# Altium schematic sheet Power.SchDoc: Plant - Power
size A4; Author: Carlos de la Fuente; CompanyName: ekuore; DrawnBy: Carlos de la Fuente; Engineer: Carlos de la Fuente; Organization: eKuore; Revision: 0.2; SheetNumber: 3; SheetTotal: 5
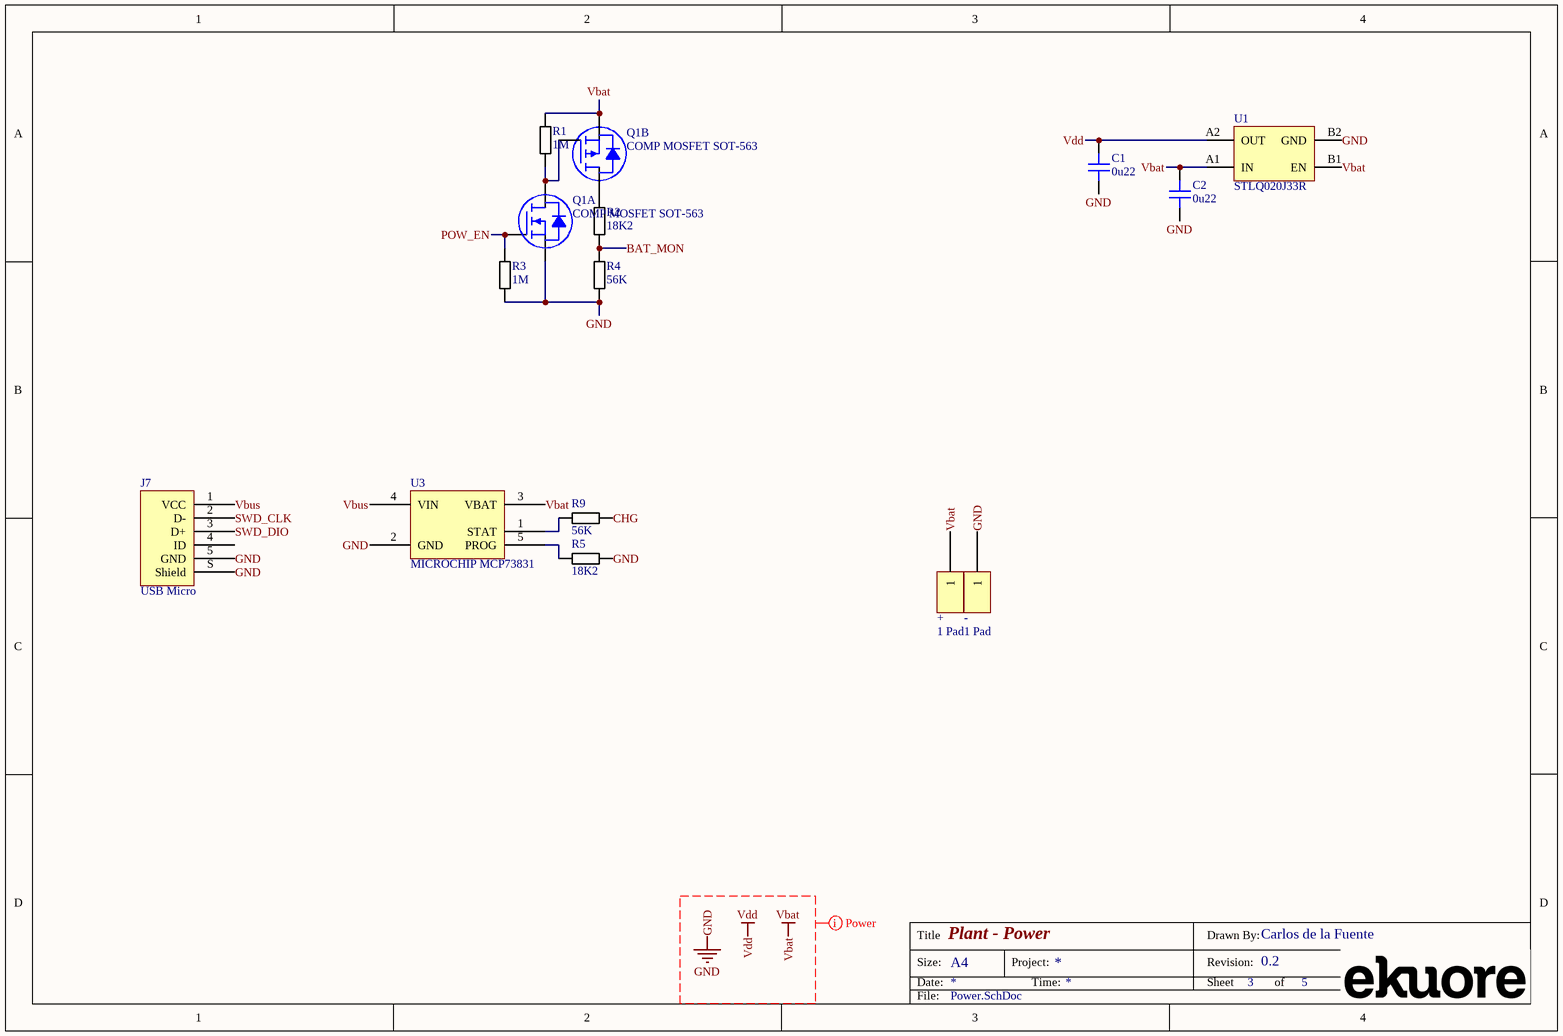
[diagram p0: Power.SchDoc]

## Parts
+  1 Pad  [HARWIN P70 - CONTACT]  (no BOM)
-  1 Pad  [HARWIN P70 - CONTACT]  (no BOM)
C1  0u22  [CAP 0201/0603]
C2  0u22  [CAP 0201/0603]
J7  USB Micro  [Amphenol 10118192]
Q1  COMP MOSFET SOT-563  [ON SEMI SOT563]  (parts A,B of 2)
R1  1M  [RES 0402/1005]
R2  18K2  [RES 0402/1005]
R3  1M  [RES 0402/1005]
R4  56K  [RES 0402/1005]
R5  18K2  [RES 0402/1005]
R9  56K  [RES 0402/1005]
U1  STLQ020J33R  [ST flip-chip4]
U3  MICROCHIP MCP73831  [MICROCHIP SOT-23-5]

## Nets
GND: -.1 C1.1 C2.1 J7.5(GND) J7.S(Shield) Q1.1(S1) R3.1 R4.1 R5.1 U1.B2(GND) U3.2(GND)
Vbat: +.1 C2.2 Q1.4(S2) R1.2 U1.A1(IN) U1.B1(EN) U3.3(VBAT)
Vdd: C1.2 U1.A2(OUT)
BAT_MON: R2.1 R4.2
CHG: R9.2
POW_EN: Q1.2(G1) R3.2
SWD_CLK: J7.2(D-)
SWD_DIO: J7.3(D+)
Vbus: J7.1(VCC) U3.4(VIN)
NetQ1_3: Q1.3(D2) R2.2
NetQ1_5: Q1.5(G2) Q1.6(D1) R1.1
NetR5_2: R5.2 U3.5(PROG)
NetR9_1: R9.1 U3.1(STAT)

Not connected (* = marked no-connect by the designer): J7 4(ID)

## Layout directives
net class Power: GND, Vbat, Vdd

## Notes on the sheet
- Title
- Size:
- Date:
- A4
- Project:
- Time:
- Sheet
- Drawn By:
- Revision:
- of
- File:

## Library data of the parts
+ - = P70 - Contact: CONTACT PAD P70 Pogo pin series; Part Number: P70 - Contact; Value: PAD; Creation Date: 06/04/2021; Revision Date: 06/04/2021
C1 C2 = GRM033R61A224KE90D: CAP CER 0201 0.22uF 10V 10% X5R; Manufacturer: Murata; Note: recommended; Capacitance: 220nF; Value: 0u22; Part Number: GRM033R61A224KE90D; Creation Date: 19/01/2021; Revision Date: 19/01/2021; Supplier 1: Digi-Key; Supplier Part Number 1: 490-10411-1-ND; Manufacturer Part Number: GRM033R61A224KE90D; Stock 1: 951885; Pricing 1: 1=0,10000, 10=0,03600, 50=0,01980, 100=0,01620, 500=0,01156, 1000=0,00908, 2500=0,00825, 5000=0,00759 (USD); RoHS: Yes; Mount: Surface Mount; Case/Package: 0201; Min Operating Temperature: -55°C; Max Operating Temperature: 85°C; Tolerance: 10%; Packaging: Tape and Reel; Voltage Rating (DC): 10V; Length: 0.024inch; Height: 0.5mm; Width: 0.012inch; Lead Free: Lead Free; ComponentLink1URL: http://www.farnell.com/datasheets/2867835.pdf?src-supplier=Farnell; ComponentLink1Description: http://www.farnell.com/datasheets/2867835.pdf?src-supplier=Farnell; Case Code (Imperial): 0201; Case Code (Metric): 0603; Voltage Rating: 10V; Dielectric: X5R; Thickness: 0.013inch; ComponentLink2URL: http://www.mouser.com/ds/2/281/c02e-2905.pdf?src-s; ComponentLink2Description: http://www.mouser.com/ds/2/281/c02e-2905.pdf?src-s; ComponentLink3URL: http://search.murata.co.jp/Ceramy/image/img/A01X/G; ComponentLink3Description: http://search.murata.co.jp/Ceramy/image/img/A01X/G; ComponentLink4URL: http://www.farnell.com/datasheets/2867835.pdf?src-; ComponentLink4Description: http://www.farnell.com/datasheets/2867835.pdf?src-; ComponentLink5URL: http://www.mouser.com/ds/2/281/c02e-2905.pdf?src-s; ComponentLink5Description: http://www.mouser.com/ds/2/281/c02e-2905.pdf?src-s; ComponentLink6URL: http://search.murata.co.jp/Ceramy/image/img/A01X/G; ComponentLink6Description: http://search.murata.co.jp/Ceramy/image/img/A01X/G; ComponentLink7URL: http://search.murata.co.jp/Ceramy/image/img/A01X/p; ComponentLink7Description: http://search.murata.co.jp/Ceramy/image/img/A01X/p; Manufacturer 1: Murata; Manufacturer Part Number 1: GRM033R61A224KE90D; RoHS Compliant: Yes; Resistor Type: Ceramic
J7 = 10118192-0001LF: CONN RCP USB2.0 MICRO B SMD R/A; Manufacturer: Amphenol FCI; System: Connector; Current Rating: 1.8A; Gender: Receptacle; Connector Type: USB,Receptacle; Number of Contacts: 5; Pitch: 0.65mm; Part Number: 10118192-0001LF; Value: USB; Creation Date: 25/02/2020; Revision Date: 27/02/2020; Supplier 1: Digi-Key; Supplier Part Number 1: 609-4613-1-ND; Manufacturer Part Number: 10118192-0001LF; Stock 1: 20765; Pricing 1: 1=0,43000, 10=0,40500, 25=0,36480, 50=0,32420, 100=0,31070, 250=0,28368, 500=0,27016 (USD); RoHS: Yes; Mount: Surface Mount,Horizontal; Contact Material: Copper Alloy; Packaging: Tape and Reel; Package Quantity: 1400; Length: 7.86mm; REACH SVHC: No SVHC; ComponentLink1URL: https://datasheet.ciiva.com/26853/getdatasheetpartid-418041-26853891.pdf?src-supplier=Verical; ComponentLink1Description: https://datasheet.ciiva.com/26853/getdatasheetpartid-418041-26853891.pdf?src-supplier=Verical; ComponentLink2URL: https://datasheet.ciiva.com/851/10118192-851112.pdf?src-supplier=Digi-Key; ComponentLink2Description: https://datasheet.ciiva.com/851/10118192-851112.pdf?src-supplier=Digi-Key; Contact Plating: Gold; Color: Black; Housing Material: Polymer; Min Operating Temperature: -55°C; Max Operating Temperature: 85°C; Termination: Solder; Orientation: Right Angle; Depth: 5.57mm; Flammability Rating: UL94 V-0
Q1 = NTZD3155CT1G: MOSFET N/P-CH 20V 0.54A/-0.43A SOT563; Manufacturer: ON Semiconductor; Max Power Dissipation: 250mW; Number of Elements: 2; Part Number: NTZD3155CT1G; Revision Date: 27/01/2021; Creation Date: 27/01/2021; Supplier 1: Digi-Key; Supplier Part Number 1: NTZD3155CT1GOSCT-ND; Manufacturer Part Number: NTZD3155CT1G; Stock 1: 48898; Pricing 1: 1=0,49000, 10=0,34400, 25=0,32960, 100=0,17370, 50; RoHS: Yes; Case/Package: SOT-563; Number of Pins: 6; Contact Plating: Tin,Matte; Min Operating Temperature: -55°C; Max Operating Temperature: 150°C; Package Quantity: 1; Packaging: Tape and Reel
R1 R3 = RC0402FR-071ML: RES 0402 1M 1%  63mW; Manufacturer: Yageo; Note: recommended; Temperature Coefficient: 100ppm/°C; Resistance: 1MR; Value: 1M; Part Number: RC0402FR-071ML; Creation Date: 07/05/2019; Revision Date: 08/05/2019; Supplier 1: Digi-Key; Supplier Part Number 1: 311-1.00MLRCT-ND; Manufacturer Part Number: RC0402FR-071ML; Stock 1: 14535916; Pricing 1: 1 = 0,10000, 10 = 0,01600, 100 = 0,00670, 1000 = 0,00301, 2500 = 0,00261, 5000 = 0,00215 (USD); RoHS: Yes; Case/Package: 0402; Min Operating Temperature: -55°C; Max Operating Temperature: 155°C; Tolerance: 1%; Packaging: Tape and Reel; Power Rating: 63mW; Length: 1mm; Height: 0.32mm; Depth: 0.5mm; REACH SVHC: Unknown; Lead Free: Lead Free; ComponentLink1URL: https://datasheet.ciiva.com/11808/0900766b80c66297-11808125.pdf?src-supplier=RSComponents; ComponentLink1Description: https://datasheet.ciiva.com/11808/0900766b80c66297-11808125.pdf?src-supplier=RSComponents
R2 R5 = RC0402FR-0718K2L: RES 0402 18K2 1%  63mW; Manufacturer: Yageo; Note: recommended; Temperature Coefficient: 100ppm/°C; Resistance: 18.2kR; Voltage Rating (DC): 50V; Power Rating: 62.5mW; Value: 18K2; Part Number: RC0402FR-0718K2L; Creation Date: 02/07/2019; Revision Date: 02/07/2019; Supplier 1: Digi-Key; Supplier Part Number 1: YAG2371CT-ND; Manufacturer Part Number: RC0402FR-0718K2L; Stock 1: 493024; Pricing 1: 1=0,10000, 10=0,01600, 100=0,00670, 1000=0,00301, 2500=0,00261, 5000=0,00215 (USD); RoHS: Yes; Case/Package: 0402; Min Operating Temperature: -55°C; Max Operating Temperature: 155°C; Tolerance: 1%; Packaging: Tape and Reel; Length: 1mm; Height: 0.016inch; Width: 0.02inch; Depth: 0.5mm; ComponentLink1URL: https://datasheet.ciiva.com/16741/pyu-rc0402-51-rohs-l-6-r-16741879.pdf?src-supplier=Future+Electronics; ComponentLink1Description: https://datasheet.ciiva.com/16741/pyu-rc0402-51-rohs-l-6-r-16741879.pdf?src-supplier=Future+Electronics; Case Code (Imperial): 0402; Case Code (Metric): 1005; Voltage Rating: 50V; Package Quantity: 10000; Termination: SMD/SMT; Composition: Thick Film; Number of Terminations: 2; Military Standard: Not; Max Power Dissipation: 63mW; Features: Moisture Resistant; Radiation Hardening: No; ComponentLink2URL: https://datasheet.ciiva.com/2552/pyu-r-int-thick-7; ComponentLink2Description: https://datasheet.ciiva.com/2552/pyu-r-int-thick-7; ComponentLink3URL: https://datasheet.ciiva.com/5596/pyu-rc0402-51-roh; ComponentLink3Description: https://datasheet.ciiva.com/5596/pyu-rc0402-51-roh; ComponentLink4URL: https://datasheet.ciiva.com/16869/pyu-rc0402-51-ro; ComponentLink4Description: https://datasheet.ciiva.com/16869/pyu-rc0402-51-ro; ComponentLink5URL: https://datasheet.ciiva.com/28403/pyu-rc0402-51-ro; ComponentLink5Description: https://datasheet.ciiva.com/28403/pyu-rc0402-51-ro; Working Voltage: 50V; Contact Plating: Tin
R4 R9 = RC0402FR-0756KL: RES 0402 56K 1%  63mW; Manufacturer: Yageo; Temperature Coefficient: 100ppm/°C; Resistance: 56kR; Power Rating: 62.5mW; Voltage Rating: 50V; Note: recommended; Value: 56K; Part Number: RC0402FR-0756KL; Supplier 1: Digi-Key; Supplier Part Number 1: 311-56.0KLRDKR-ND; Manufacturer Part Number: RC0402FR-0756KL; Stock 1: 25395; Pricing 1: 1=0,10000, 10=0,01600, 100=0,00640, 1000=0,00289, 2500=0,00251, 5000=0,00207 (USD); RoHS: Yes; Case/Package: 0402; Min Operating Temperature: -55°C; Max Operating Temperature: 155°C; Tolerance: 1%; Packaging: Tape and Reel; Length: 1mm; Height: 0.016inch; Width: 0.02inch; Depth: 0.5mm; REACH SVHC: No SVHC; ComponentLink1URL: https://datasheet.ciiva.com/2453/pyu-r-int-thick-7-2453478.pdf?src-supplier=Digi-Key; ComponentLink1Description: https://datasheet.ciiva.com/2453/pyu-r-int-thick-7-2453478.pdf?src-supplier=Digi-Key; Case Code (Imperial): 0402; Case Code (Metric): 1005; Package Quantity: 1; Termination: SMD/SMT; Composition: Thick Film; Number of Terminations: 2; Military Standard: Not; Max Power Dissipation: 63mW; Features: Moisture Resistant; ComponentLink2URL: https://datasheet.ciiva.com/2453/pyu-r-int-thick-7; ComponentLink2Description: https://datasheet.ciiva.com/2453/pyu-r-int-thick-7; ComponentLink3URL: https://datasheet.ciiva.com/5558/pyu-rc0402-51-roh; ComponentLink3Description: https://datasheet.ciiva.com/5558/pyu-rc0402-51-roh; ComponentLink4URL: https://datasheet.ciiva.com/2453/pyu-r-int-thick-7; ComponentLink4Description: https://datasheet.ciiva.com/2453/pyu-r-int-thick-7; ComponentLink5URL: https://datasheet.ciiva.com/46412/1018594-46412840; ComponentLink5Description: https://datasheet.ciiva.com/46412/1018594-46412840; Working Voltage: 50V; ComponentLink6URL: https://datasheet.ciiva.com/7850/1018594-7850044.p; ComponentLink6Description: https://datasheet.ciiva.com/7850/1018594-7850044.p; ComponentLink7URL: https://datasheet.ciiva.com/7850/1018594-7850045.p; ComponentLink7Description: https://datasheet.ciiva.com/7850/1018594-7850045.p; Creation Date: 16/12/2020; Revision Date: 16/12/2020
U1 = STLQ020J33R: IC REG LIN 3.3V 200MA 4FLIPCHIP; Manufacturer: STMicroelectronics; Part Number: STLQ020J33R; Revision Date: 28/10/2019; Creation Date: 28/10/2019; Supplier 1: Digi-Key; Supplier Part Number 1: 497-18117-1-ND; Manufacturer Part Number: STLQ020J33R; Stock 1: 2546; Pricing 1: 1=0,57000, 10=0,49100, 100=0,36680, 500=0,28820, 1; RoHS: No; ComponentLink1URL: https://www.st.com/resource/en/datasheet/stlq020.p; ComponentLink1Description: https://www.st.com/resource/en/datasheet/stlq020.p
U3 = MCP73831T-2ACI/OT: MICROCHIP - MCP73831T-2ACI/OT - LI-ION/LI-POLY CHA; Number of Cells: 1; Output Voltage: 4.2V; Max Supply Voltage: 6V; Min Supply Voltage: 3.75V; Output Current: 500mA; Max Output Voltage: 4.5V; Min Output Voltage: 4.168V; Max Power Dissipation: 1.54W; Drain to Source Resistance: 350mR; Voltage Rating: 4.534V; Part Number: MCP73831T-2ACI/OT; Revision Date: 08/05/2019; Creation Date: 08/05/2019; Supplier 1: Digi-Key; Supplier Part Number 1: MCP73831T-2ACI/OTDKR-ND; Manufacturer: Microchip; Manufacturer Part Number: MCP73831T-2ACI/OT; Stock 1: 40920; Pricing 1: 1 = 0,58000, 25 = 0,48400, 100 = 0,43260 (USD); RoHS: Yes; Mount: Surface Mount; Case/Package: SOT-23; Number of Pins: 5; Weight: 0.00709oz; Contact Plating: Tin; Min Operating Temperature: -40°C; Max Operating Temperature: 85°C; Packaging: Tape and Reel; Max Charge Current: 500mA; Max Input Voltage: 6V; Number of Outputs: 1; Number of Channels: 1; Termination: SMD/SMT; Length: 0.122inch; Height: 0.051inch; Width: 0.071inch; Radiation Hardening: No; REACH SVHC: No SVHC; Lead Free: Lead Free; ComponentLink1URL: https://datasheet.ciiva.com/22828/0900766b80d2b53a; ComponentLink1Description: https://datasheet.ciiva.com/22828/0900766b80d2b53a